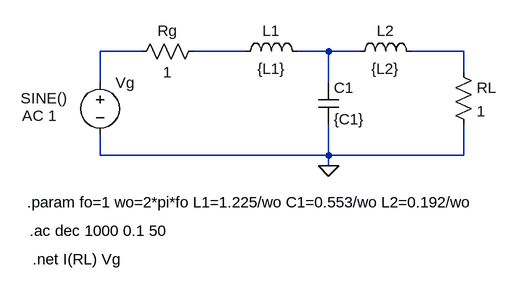
[diagram p0: schematic TS13.asc]
TS13.asc, the LTspice schematic file:
Version 4
SHEET 1 880 680
WIRE 144 112 80 112
WIRE 304 112 224 112
WIRE 432 112 384 112
WIRE 480 112 432 112
WIRE 640 112 560 112
WIRE 640 144 640 112
WIRE 80 160 80 112
WIRE 432 160 432 112
WIRE 80 272 80 240
WIRE 432 272 432 224
WIRE 432 272 80 272
WIRE 640 272 640 224
WIRE 640 272 432 272
WIRE 432 288 432 272
FLAG 432 288 0
SYMBOL voltage 80 144 R0
WINDOW 3 -122 40 Left 2
WINDOW 123 -120 67 Left 2
WINDOW 39 0 0 Left 0
SYMATTR InstName Vg
SYMATTR Value SINE()
SYMATTR Value2 AC 1
SYMBOL res 240 96 R90
WINDOW 0 0 56 VBottom 2
WINDOW 3 32 56 VTop 2
SYMATTR InstName Rg
SYMATTR Value 1
SYMBOL ind 288 128 R270
WINDOW 0 32 56 VTop 2
WINDOW 3 5 56 VBottom 2
SYMATTR InstName L1
SYMATTR Value {L1}
SYMBOL ind 464 128 R270
WINDOW 0 32 56 VTop 2
WINDOW 3 5 56 VBottom 2
SYMATTR InstName L2
SYMATTR Value {L2}
SYMBOL cap 416 160 R0
SYMATTR InstName C1
SYMATTR Value {C1}
SYMBOL res 624 128 R0
SYMATTR InstName RL
SYMATTR Value 1
TEXT -32 344 Left 2 !.param fo=1 wo=2*pi*fo L1=1.225/wo C1=0.553/wo L2=0.192/wo
TEXT -28 388 Left 2 !.ac dec 1000 0.1 50
TEXT -24 432 Left 2 !.net I(RL) Vg

The netlist it stands for:
* TS13.asc
Vg N001 0 SINE() AC 1
Rg N002 N001 1
L1 N002 N003 {L1}
L2 N003 N004 {L2}
C1 N003 0 {C1}
RL N004 0 1
.param fo=1 wo=2*pi*fo L1=1.225/wo C1=0.553/wo L2=0.192/wo
.ac dec 1000 0.1 50
.net I(RL) Vg
.backanno
.end